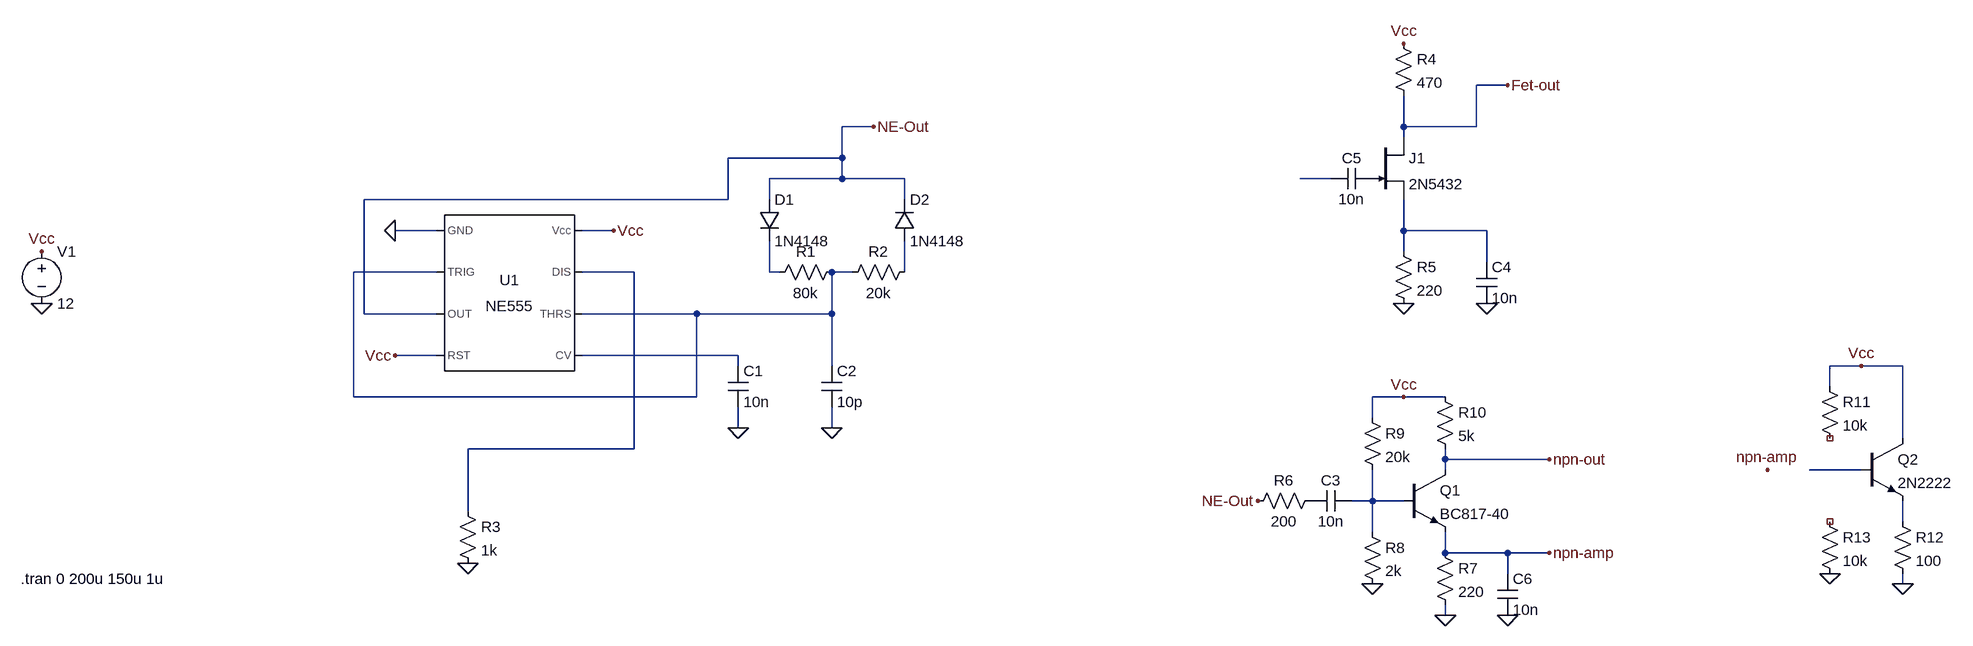
[diagram p0: schematic NE555_PWM.asc]
NE555_PWM.asc, the LTspice schematic file:
Version 4
SHEET 1 3284 680
WIRE 1728 -256 1680 -256
WIRE 752 -192 704 -192
WIRE 1568 -192 1568 -240
WIRE 1680 -192 1680 -256
WIRE 1680 -192 1568 -192
WIRE 1568 -176 1568 -192
WIRE 704 -144 704 -192
WIRE 704 -144 528 -144
WIRE 704 -112 704 -144
WIRE 704 -112 592 -112
WIRE 800 -112 704 -112
WIRE 1456 -112 1408 -112
WIRE 528 -80 528 -144
WIRE 528 -80 -32 -80
WIRE 592 -80 592 -112
WIRE 800 -80 800 -112
WIRE 80 -32 16 -32
WIRE 352 -32 304 -32
WIRE 1568 -32 1568 -80
WIRE 1696 -32 1568 -32
WIRE 1568 0 1568 -32
WIRE 1696 16 1696 -32
WIRE 80 32 -48 32
WIRE 384 32 304 32
WIRE 592 32 592 -16
WIRE 608 32 592 32
WIRE 720 32 688 32
WIRE 800 32 800 -16
WIRE -32 96 -32 -80
WIRE 80 96 -32 96
WIRE 480 96 304 96
WIRE 688 96 688 32
WIRE 688 96 480 96
WIRE 80 160 16 160
WIRE 544 160 304 160
WIRE 544 176 544 160
WIRE 688 176 688 96
WIRE 2272 176 2224 176
WIRE 2336 176 2272 176
WIRE 2224 208 2224 176
WIRE -48 224 -48 32
WIRE 480 224 480 96
WIRE 480 224 -48 224
WIRE 1568 224 1520 224
WIRE 1632 224 1568 224
WIRE 1520 256 1520 224
WIRE 544 272 544 240
WIRE 688 272 688 240
WIRE 2336 288 2336 176
WIRE 384 304 384 32
WIRE 384 304 128 304
WIRE 1632 320 1632 304
WIRE 1792 320 1632 320
WIRE 1632 336 1632 320
WIRE 2272 336 2192 336
WIRE 1520 384 1520 336
WIRE 1520 384 1488 384
WIRE 1568 384 1520 384
WIRE 128 400 128 304
WIRE 2336 416 2336 384
WIRE 1520 432 1520 384
WIRE 1632 464 1632 432
WIRE 1728 464 1632 464
WIRE 1792 464 1728 464
WIRE 1728 496 1728 464
WIRE 2336 512 2336 496
WIRE 1632 560 1632 544
FLAG 16 -32 0
FLAG -528 80 0
FLAG -528 0 Vcc
FLAG 352 -32 Vcc
FLAG 16 160 Vcc
FLAG 544 272 0
FLAG 688 272 0
FLAG 128 480 0
FLAG 1568 80 0
FLAG 1568 -320 Vcc
FLAG 1696 80 0
FLAG 752 -192 NE-Out
FLAG 1728 -256 Fet-out
FLAG 1792 320 npn-out
FLAG 1568 224 Vcc
FLAG 1632 560 0
FLAG 1344 384 NE-Out
FLAG 1792 464 npn-amp
FLAG 2272 176 Vcc
FLAG 2336 512 0
FLAG 2224 496 0
FLAG 2128 336 npn-amp
FLAG 1728 560 0
FLAG 1520 512 0
SYMBOL Misc\\NE555 192 64 R0
SYMATTR InstName U1
SYMBOL voltage -528 -16 R0
WINDOW 123 0 0 Left 0
WINDOW 39 0 0 Left 0
SYMATTR InstName V1
SYMATTR Value 12
SYMBOL cap 528 176 R0
SYMATTR InstName C1
SYMATTR Value 10n
SYMBOL cap 672 176 R0
SYMATTR InstName C2
SYMATTR Value 10p
SYMBOL res 592 48 R270
WINDOW 0 32 56 VTop 2
WINDOW 3 0 56 VBottom 2
SYMATTR InstName R1
SYMATTR Value 80k
SYMBOL res 704 48 R270
WINDOW 0 32 56 VTop 2
WINDOW 3 0 56 VBottom 2
SYMATTR InstName R2
SYMATTR Value 20k
SYMBOL diode 576 -80 R0
SYMATTR InstName D1
SYMATTR Value 1N4148
SYMBOL diode 784 -16 M180
WINDOW 0 24 64 Left 2
WINDOW 3 24 0 Left 2
SYMATTR InstName D2
SYMATTR Value 1N4148
SYMBOL res 112 384 R0
SYMATTR InstName R3
SYMATTR Value 1k
SYMBOL njf 1520 -176 R0
SYMATTR InstName J1
SYMATTR Value 2N5432
SYMBOL res 1552 -336 R0
SYMATTR InstName R4
SYMATTR Value 470
SYMBOL res 1552 -16 R0
SYMATTR InstName R5
SYMATTR Value 220
SYMBOL cap 1680 16 R0
SYMATTR InstName C4
SYMATTR Value 10n
SYMBOL res 1616 208 R0
SYMATTR InstName R10
SYMATTR Value 5k
SYMBOL cap 1488 368 R90
WINDOW 0 0 32 VBottom 2
WINDOW 3 32 32 VTop 2
SYMATTR InstName C3
SYMATTR Value 10n
SYMBOL res 1504 240 R0
SYMATTR InstName R9
SYMATTR Value 20k
SYMBOL cap 1520 -128 R90
WINDOW 0 0 32 VBottom 2
WINDOW 3 32 32 VTop 2
SYMATTR InstName C5
SYMATTR Value 10n
SYMBOL res 1616 448 R0
SYMATTR InstName R7
SYMATTR Value 220
SYMBOL npn 1568 336 R0
SYMATTR InstName Q1
SYMATTR Value BC817-40
SYMBOL res 2208 192 R0
SYMATTR InstName R11
SYMATTR Value 10k
SYMBOL res 2208 400 R0
SYMATTR InstName R13
SYMATTR Value 10k
SYMBOL npn 2272 288 R0
SYMATTR InstName Q2
SYMATTR Value 2N2222
SYMBOL res 2320 400 R0
SYMATTR InstName R12
SYMATTR Value 100
SYMBOL cap 1712 496 R0
SYMATTR InstName C6
SYMATTR Value 10n
SYMBOL res 1440 368 R90
WINDOW 0 0 56 VBottom 2
WINDOW 3 32 56 VTop 2
SYMATTR InstName R6
SYMATTR Value 200
SYMBOL res 1504 416 R0
SYMATTR InstName R8
SYMATTR Value 2k
TEXT -560 504 Left 2 !.tran 0 200u 150u 1u

The netlist it stands for:
* NE555_PWM.asc
XU1 0 N003 NE-Out Vcc N007 N003 N004 Vcc NE555  ; pins GND TRIG OUT RST CV THRS DIS Vcc
V1 Vcc 0 12
C1 N007 0 10n
C2 N003 0 10p
R1 N005 N003 80k
R2 N003 N006 20k
D1 NE-Out N005 1N4148
D2 N006 NE-Out 1N4148
R3 N004 0 1k
J1 Fet-out P001 N002 2N5432
R4 Vcc Fet-out 470
R5 N002 0 220
C4 N002 0 10n
R10 Vcc npn-out 5k
C3 N009 P002 10n
R9 Vcc N009 20k
C5 P001 N001 10n
R7 npn-amp 0 220
Q1 npn-out N009 npn-amp 0 BC817-40
R11 Vcc NC_01 10k
R13 NC_02 0 10k
Q2 Vcc N008 N010 0 2N2222
R12 N010 0 100
C6 npn-amp 0 10n
R6 P002 NE-Out 200
R8 N009 0 2k
.model D D
.lib standard.dio
.model NPN NPN
.model PNP PNP
.lib standard.bjt
.model NJF NJF
.model PJF PJF
.lib standard.jft
.tran 0 200u 150u 1u
.lib NE555.sub
.backanno
.end